# EAGLE schematic clock (EAGLE 9.4.2)
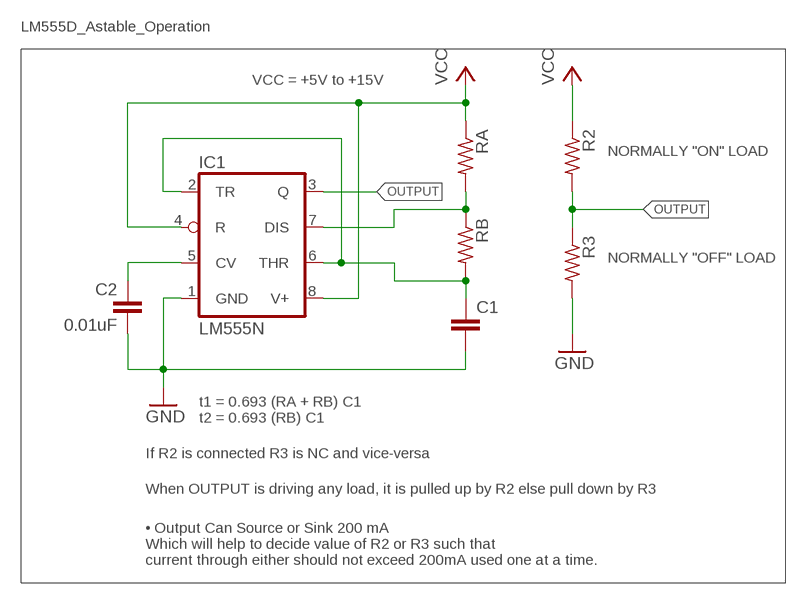
[diagram p0: schematic, sheet 1]

## Parts
C1  C-EU025-025X050  [C025-025X050]
C2  0.01uF  C-EU025-025X050  [C025-025X050]
IC1  LM555N  [DIL08]
R2  R-US_R0805  [R0805]
R3  R-US_R0805  [R0805]
RA  R-US_R0805  [R0805]
RB  R-US_R0805  [R0805]

## Nets
GND: C1.2 C2.2 IC1.1(GND) R3.2
N$1: C1.1 IC1.2(TR) IC1.6(THR) RB.2
N$3: IC1.7(DIS) RA.2 RB.1
N$4: C2.1 IC1.5(CV)
OUTPUT: IC1.3(Q) R2.2 R3.1
VCC: IC1.4(R) IC1.8(V+) R2.1 RA.1

## Notes on the sheet
- LM555D_Astable_Operation
- VCC = +5V to +15V
- NORMALLY "ON" LOAD
- NORMALLY "OFF" LOAD
- t1 = 0.693 (RA + RB) C1
  t2 = 0.693 (RB) C1
- If R2 is connected R3 is NC and vice-versa
- When OUTPUT is driving any load, it is pulled up by R2 else pull down by R3
- • Output Can Source or Sink 200 mA
  Which will help to decide value of R2 or R3 such that 
  current through either should not exceed 200mA used one at a time.

## Library data of the parts
C1 C2 = rcl:C-EU: CAPACITOR, European symbol
IC1 = linear:*555: TIMER
R2 R3 RA RB = rcl:R-US_: RESISTOR, American symbol